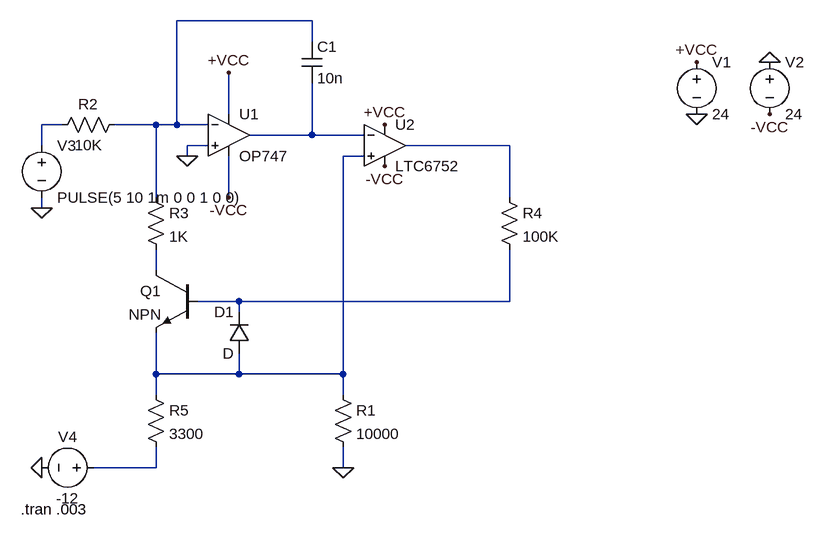
[diagram p0: schematic ej6tp4 VCO ONDA CUADRADA.asc]
ej6tp4 VCO ONDA CUADRADA.asc, the LTspice schematic file:
Version 4
SHEET 1 912 832
WIRE 144 64 -64 64
WIRE 144 96 144 64
WIRE 16 208 16 144
WIRE -240 224 -272 224
WIRE -96 224 -160 224
WIRE -64 224 -64 64
WIRE -64 224 -96 224
WIRE -16 224 -64 224
WIRE 144 240 144 160
WIRE 144 240 48 240
WIRE 224 240 144 240
WIRE -272 256 -272 224
WIRE -16 256 -48 256
WIRE 448 256 288 256
WIRE -48 272 -48 256
WIRE 224 272 192 272
WIRE -96 336 -96 224
WIRE 16 336 16 272
WIRE 448 336 448 256
WIRE -272 352 -272 336
WIRE -96 448 -96 416
WIRE 32 496 -32 496
WIRE 448 496 448 416
WIRE 448 496 32 496
WIRE 32 512 32 496
WIRE -96 608 -96 544
WIRE 32 608 32 576
WIRE 32 608 -96 608
WIRE 192 608 192 272
WIRE 192 608 32 608
WIRE -96 640 -96 608
WIRE 192 640 192 608
WIRE -96 752 -96 720
WIRE -96 752 -192 752
WIRE 192 752 192 720
FLAG 16 336 -VCC
FLAG 256 288 -VCC
FLAG 256 224 +VCC
FLAG 16 144 +VCC
FLAG 736 208 0
FLAG 848 128 0
FLAG 848 208 -VCC
FLAG 736 128 +VCC
FLAG -272 352 0
FLAG -48 272 0
FLAG 192 752 0
FLAG -272 752 0
SYMBOL Opamps\\OP747 16 176 R0
SYMATTR InstName U1
SYMBOL Comparators\\LTC6752 256 192 R0
SYMATTR InstName U2
SYMBOL voltage 736 112 R0
SYMATTR InstName V1
SYMATTR Value 24
SYMBOL voltage 848 112 R0
SYMATTR InstName V2
SYMATTR Value 24
SYMBOL voltage -272 240 R0
WINDOW 123 0 0 Left 0
WINDOW 39 0 0 Left 0
SYMATTR InstName V3
SYMATTR Value PULSE(5 10 1m 0 0 1 0 0)
SYMBOL res -144 208 R90
WINDOW 0 0 56 VBottom 2
WINDOW 3 32 56 VTop 2
SYMATTR InstName R2
SYMATTR Value 10K
SYMBOL res -112 320 R0
SYMATTR InstName R3
SYMATTR Value 1K
SYMBOL npn -32 448 M0
SYMATTR InstName Q1
SYMBOL diode 48 576 R180
WINDOW 0 24 64 Left 2
WINDOW 3 24 0 Left 2
SYMATTR InstName D1
SYMBOL res 432 320 R0
SYMATTR InstName R4
SYMATTR Value 100K
SYMBOL res 176 624 R0
SYMATTR InstName R1
SYMATTR Value 10000
SYMBOL res -112 624 R0
SYMATTR InstName R5
SYMATTR Value 3300
SYMBOL cap 128 96 R0
SYMATTR InstName C1
SYMATTR Value 10n
SYMBOL voltage -176 752 R90
WINDOW 0 -32 56 VBottom 2
WINDOW 3 32 56 VTop 2
SYMATTR InstName V4
SYMATTR Value -12
TEXT -304 816 Left 2 !.tran .003

The netlist it stands for:
* ej6tp4 VCO ONDA CUADRADA.asc
XU1 0 N001 +VCC -VCC N003 OP747  ; pins In+ In- V+ V- OUT
XU2 N005 N003 +VCC -VCC N004 LTC6752  ; pins In+ In- V+ V- OUT
V1 +VCC 0 24
V2 0 -VCC 24
V3 N002 0 PULSE(5 10 1m 0 0 1 0 0)
R2 N001 N002 10K
R3 N001 N006 1K
Q1 N006 N007 N005 0 NPN
D1 N005 N007 D
R4 N004 N007 100K
R1 N005 0 10000
R5 N005 N008 3300
C1 N001 N003 10n
V4 N008 0 -12
.model D D
.lib standard.dio
.model NPN NPN
.model PNP PNP
.lib standard.bjt
.tran .003
.lib LTC7.lib
.backanno
.end